# EasyEDA Pro project WM8904_mikroBUS_05.eprj

# Schematic Schematic1
Board Name: Board1; Create Date: 2025-12-05; Page Name: P1; Project Name: WM8904_MikroBUS_05; Schematic Name: Schematic1; Update Date: 2026-08-18; Company: EasyEDA.com; Page Size: A4; Version: V1.0
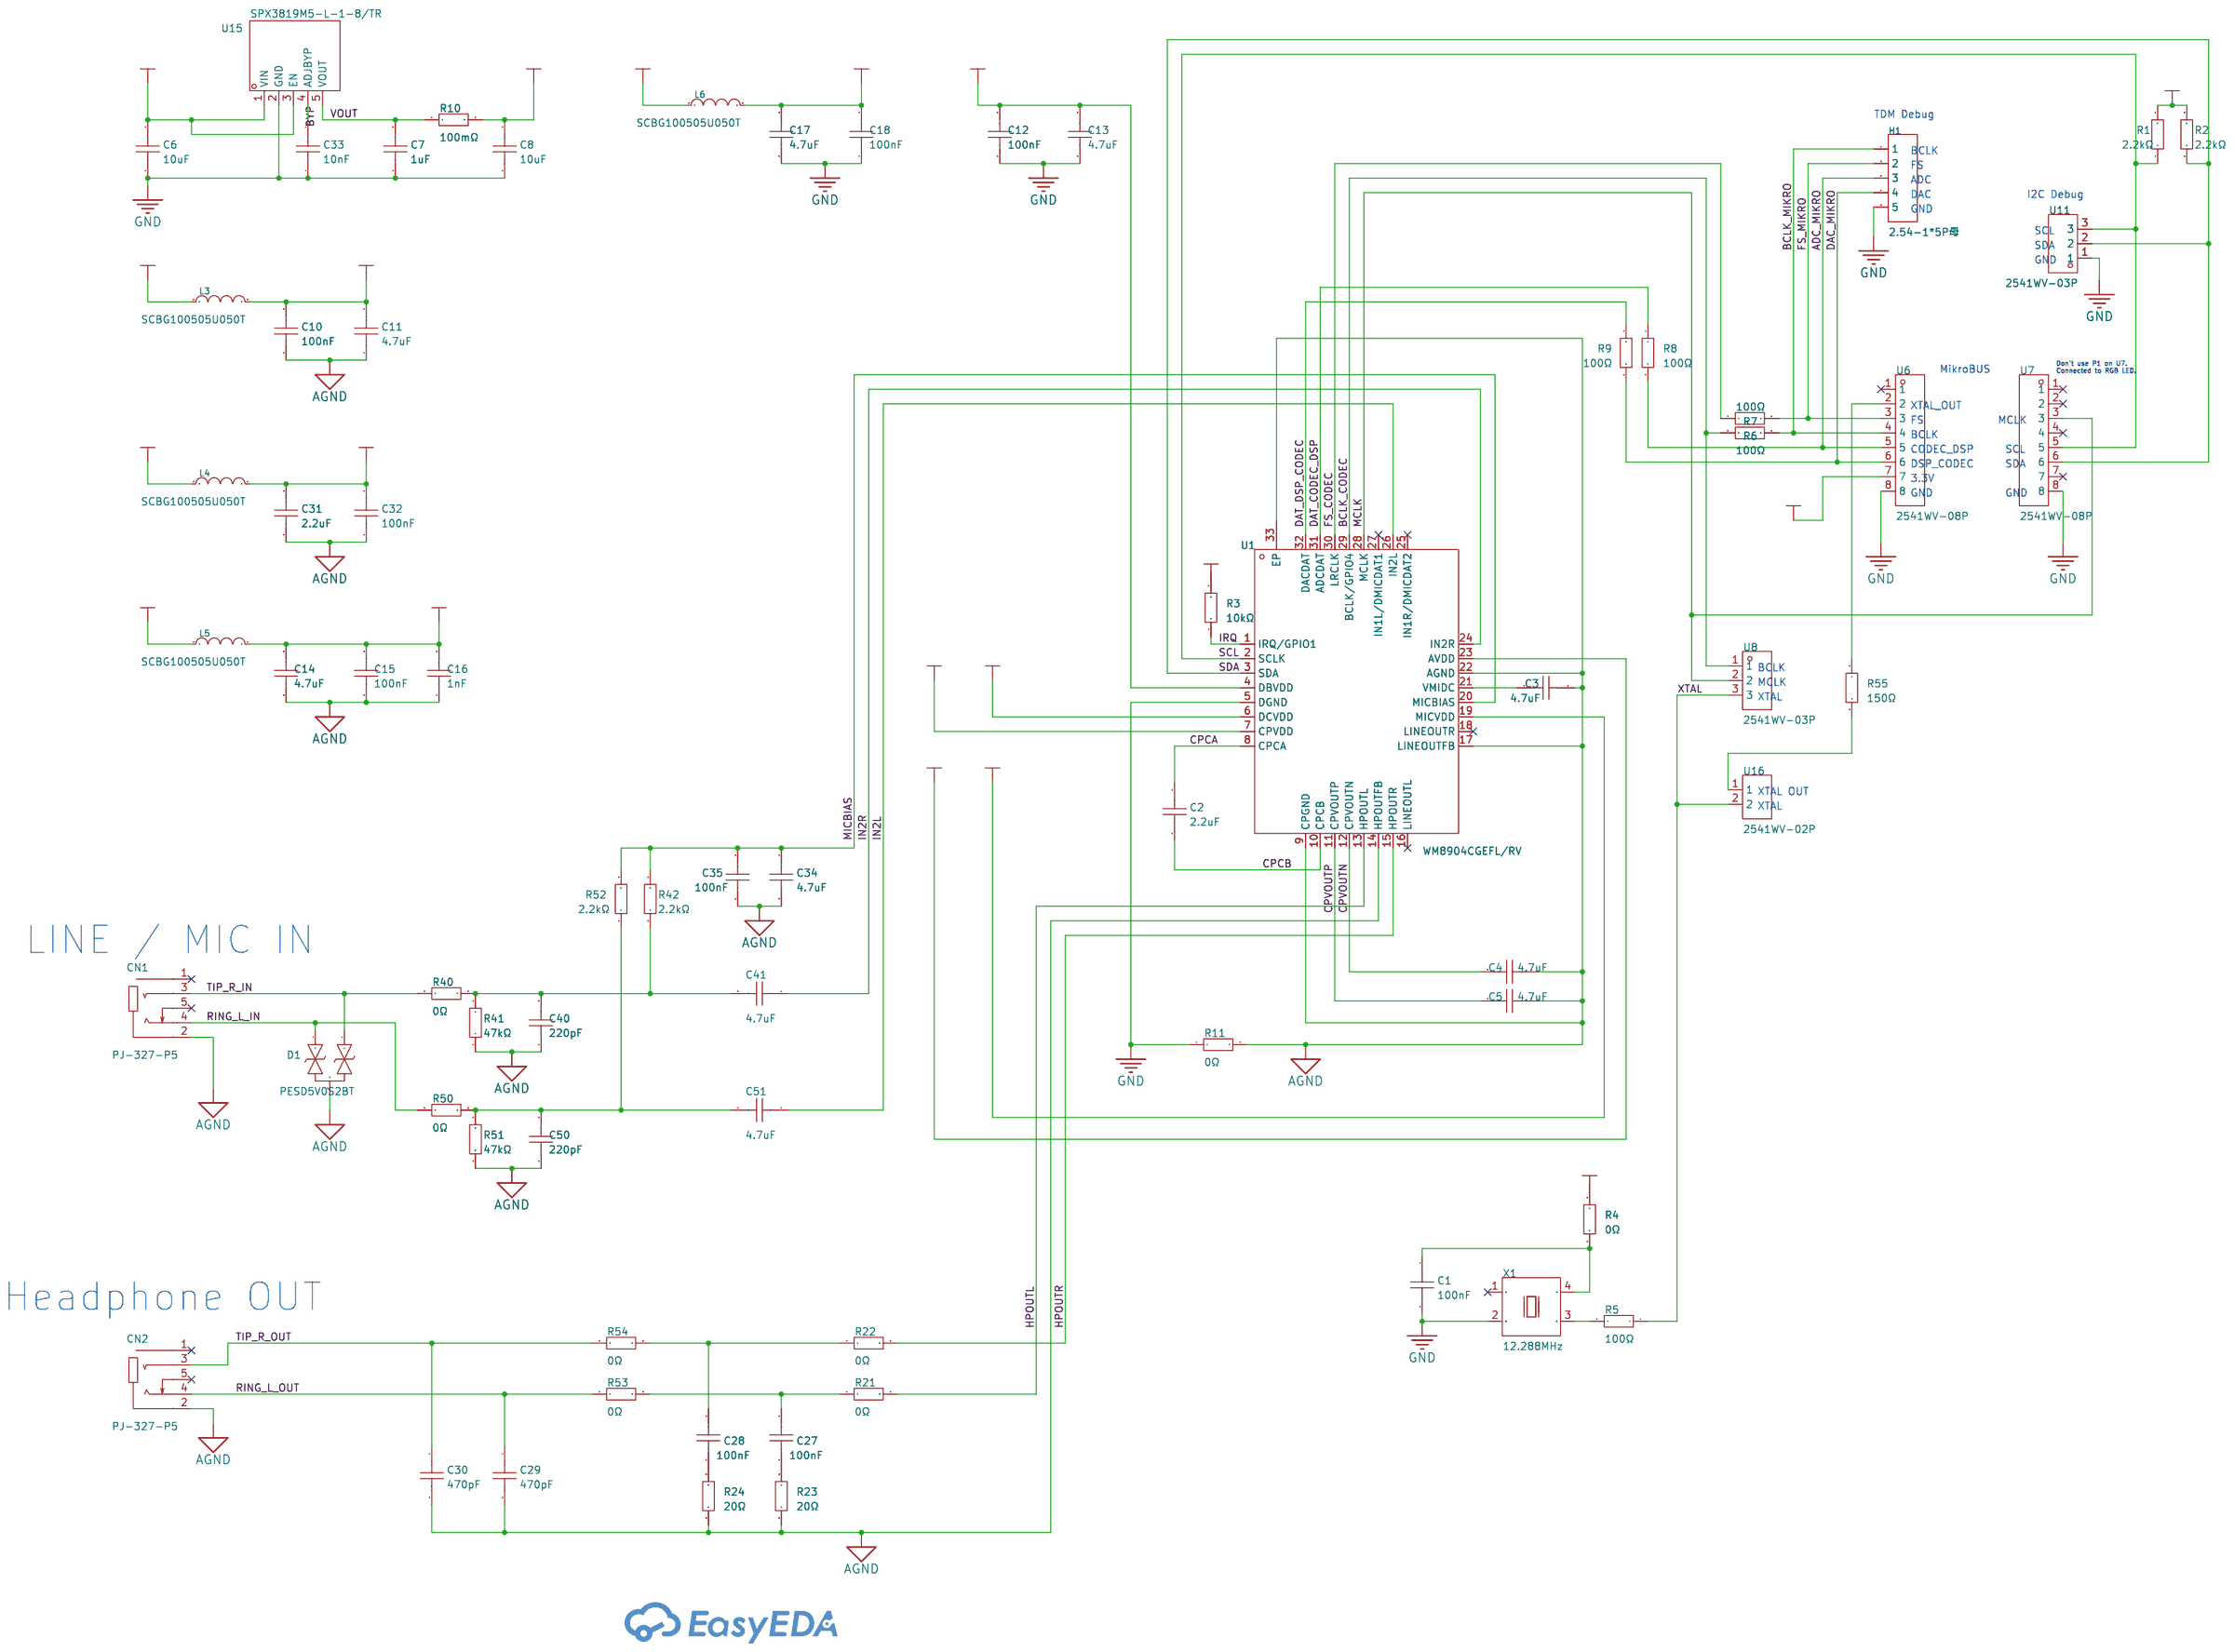
[diagram p0: schematic sheet]

## Parts
C1  100nF  [C0603]
C2  2.2uF  [C0603]
C3  4.7uF  [C0603]
C4  4.7uF  [C0603]
C5  4.7uF  [C0603]
C6  10uF  [C0603]
C7  1uF  [C0603]
C8  10uF  [C0603]
C10  100nF  [C0603]
C11  4.7uF  [C0603]
C12  100nF  [C0603]
C13  4.7uF  [C0603]
C14  4.7uF  [C0603]
C15  100nF  [C0603]
C16  1nF  [C0603]
C17  4.7uF  [C0603]
C18  100nF  [C0603]
C27  100nF  [C0603]
C28  100nF  [C0603]
C29  470pF  [C0603]
C30  470pF  [C0603]
C31  2.2uF  [C0603]
C32  100nF  [C0603]
C33  10nF  [C0603]
C34  4.7uF  [C0603]
C35  100nF  [C0603]
C40  220pF  [C0603]
C41  4.7uF  [C0603]
C50  220pF  [C0603]
C51  4.7uF  [C0603]
CN1  PJ-327-P5  [AUDIO-TH_PJ-327-P5]
CN2  PJ-327-P5  [AUDIO-TH_PJ-327-P5]
D1  PESD5V0S2BT  [SOT-23-3_L2.9-W1.3-P1.90-LS2.4-BR]
H1  2.54-1*5P母  [HDR-TH_5P-P2.54-V-F]
L3  SCBG100505U050T  [L0402]
L4  SCBG100505U050T  [L0402]
L5  SCBG100505U050T  [L0402]
L6  SCBG100505U050T  [L0402]
R1  2.2kΩ  [R0603]
R2  2.2kΩ  [R0603]
R3  10kΩ  [R0603]
R4  0Ω  [R0603]
R5  100Ω  [R0603]
R6  100Ω  [R0603]
R7  100Ω  [R0603]
R8  100Ω  [R0603]
R9  100Ω  [R0603]
R10  100mΩ  [R0603]
R11  0Ω  [R0603]
R21  0Ω  [R0603]
R22  0Ω  [R0603]
R23  20Ω  [R0603]
R24  20Ω  [R0603]
R40  0Ω  [R0603]
R41  47kΩ  [R0603]
R42  2.2kΩ  [R0603]
R50  0Ω  [R0603]
R51  47kΩ  [R0603]
R52  2.2kΩ  [R0603]
R53  0Ω  [R0603]
R54  0Ω  [R0603]
R55  150Ω  [R0603]
U1  WM8904CGEFL/RV  [QFN-32_L4.0-W4.0-P0.40-BL-EP2.7]
U6  2541WV-08P  [HDR-TH_8P-P2.54-V-M-4]
U7  2541WV-08P  [HDR-TH_8P-P2.54-V-M-4]
U8  2541WV-03P  [HDR-TH_3P-P2.54-V-M-2]
U11  2541WV-03P  [HDR-TH_3P-P2.54-V-M-2]
U15  SPX3819M5-L-1-8/TR  [SOT-23-5_L3.0-W1.7-P0.95-LS2.8-TL]
U16  2541WV-02P  [HDR-TH_2P-P2.54-V-M-1]
X1  12.288MHz  [OSC-SMD_4P-L2.5-W2.0-BL]

## Library data of the parts
C1 C10 C12 C15 C18 C27 C28 C32 = CC0603KRX7R9BB104: Capacitance:100nF Tolerance:±10% Tolerance:±10% Voltage Rating:50V Temperature Coefficient:X7R; LCSC Part Name: 100nF ±10% 50V; Supplier Part: C14663; Manufacturer: YAGEO(国巨); Supplier Footprint: 0603; JLCPCB Part Class: Basic Part; Datasheet: https://item.szlcsc.com/datasheet/CC0603KRX7R9BB104/15331.html; Supplier: LCSC; Tolerance: ±10%; Voltage Rating: 50V; Temperature Coefficient: X7R; Check: true; Standardization Check: true
C2 C31 = CL10A225KO8NNNC: Capacitance:2.2uF Tolerance:±10% Tolerance:±10% Voltage Rating:16V Temperature Coefficient:X5R; LCSC Part Name: 2.2uF ±10% 16V; Supplier Part: C23630; Manufacturer: SAMSUNG(三星); Supplier Footprint: 0603; JLCPCB Part Class: Basic Part; Datasheet: https://item.szlcsc.com/datasheet/CL10A225KO8NNNC/24366.html; Supplier: LCSC; Tolerance: ±10%; Voltage Rating: 16V; Temperature Coefficient: X5R; Check: true; Standardization Check: true
C3-C5 C11 C13 C14 C17 = CL10A475KO8NNNC: Capacitance:4.7uF Tolerance:±10% Tolerance:±10% Voltage Rating:16V Temperature Coefficient:X5R; LCSC Part Name: 4.7uF ±10% 16V; Supplier Part: C19666; Manufacturer: SAMSUNG(三星); Supplier Footprint: 0603; JLCPCB Part Class: Basic Part; Datasheet: https://item.szlcsc.com/datasheet/CL10A475KO8NNNC/20375.html; Supplier: LCSC; Tolerance: ±10%; Voltage Rating: 16V; Temperature Coefficient: X5R; Check: true; Standardization Check: true
C6 C8 = CL10A106KP8NNNC: Capacitance:10uF Tolerance:±10% Tolerance:±10% Voltage Rating:10V Temperature Coefficient:X5R; LCSC Part Name: 10uF ±10% 10V; Supplier Part: C19702; Manufacturer: SAMSUNG(三星); Supplier Footprint: 0603; JLCPCB Part Class: Basic Part; Datasheet: https://item.szlcsc.com/datasheet/CL10A106KP8NNNC/20411.html; Supplier: LCSC; Tolerance: ±10%; Voltage Rating: 10V; Temperature Coefficient: X5R; Check: true; Standardization Check: true
C7 = CL10A105KB8NNNC: Capacitance:1uF Tolerance:±10% Tolerance:±10% Voltage Rating:50V Temperature Coefficient:X5R; LCSC Part Name: 1uF ±10% 50V; Supplier Part: C15849; Manufacturer: SAMSUNG(三星); Supplier Footprint: 0603; JLCPCB Part Class: Basic Part; Datasheet: https://item.szlcsc.com/datasheet/CL10A105KB8NNNC/16531.html; Supplier: LCSC; Tolerance: ±10%; Voltage Rating: 50V; Temperature Coefficient: X5R; Check: true; Standardization Check: true
C16 = CL10B102KB8NNNC: Capacitance:1nF Tolerance:±10% Tolerance:±10% Voltage Rating:50V Temperature Coefficient:X7R; LCSC Part Name: 1nF ±10% 50V; Supplier Part: C1588; Manufacturer: SAMSUNG(三星); Supplier Footprint: 0603; JLCPCB Part Class: Basic Part; Datasheet: https://item.szlcsc.com/datasheet/CL10B102KB8NNNC/1940.html; Supplier: LCSC; Tolerance: ±10%; Voltage Rating: 50V; Temperature Coefficient: X7R; Check: true; Standardization Check: true
C29 C30 = 0603B471K500NT: Capacitance:470pF Tolerance:±10% Tolerance:±10% Voltage Rating:50V Temperature Coefficient:X7R; LCSC Part Name: 470pF ±10% 50V; Supplier Part: C1620; Manufacturer: FH(风华); Supplier Footprint: 0603; JLCPCB Part Class: Basic Part; Datasheet: https://item.szlcsc.com/datasheet/0603B471K500NT/1972.html; Supplier: LCSC; Tolerance: ±10%; Voltage Rating: 50V; Temperature Coefficient: X7R; Check: true; Standardization Check: true
C33 = 0603B103K500NT: Capacitance:10nF Tolerance:±10% Tolerance:±10% Voltage Rating:50V Temperature Coefficient:X7R; LCSC Part Name: 10nF ±10% 50V; Supplier Part: C57112; Manufacturer: FH(风华); Supplier Footprint: 0603; JLCPCB Part Class: Basic Part; Datasheet: https://item.szlcsc.com/datasheet/0603B103K500NT/58143.html; Supplier: LCSC; Tolerance: ±10%; Voltage Rating: 50V; Temperature Coefficient: X7R; Standardization Check: true; Check: true
C34 C41 C51 = CL10A475KO8NNNC: Capacitance:4.7uF Tolerance:±10% Tolerance:±10% Voltage Rating:16V Temperature Coefficient:X5R; LCSC Part Name: 4.7uF ±10% 16V; Supplier Part: C19666; Manufacturer: SAMSUNG(三星); Supplier Footprint: 0603; JLCPCB Part Class: Basic Part; Datasheet: https://item.szlcsc.com/datasheet/CL10A475KO8NNNC/20375.html; Supplier: LCSC; Tolerance: ±10%; Voltage Rating: 16V; Temperature Coefficient: X5R; Standardization Check: true; Check: true
C35 = CC0603KRX7R9BB104: Capacitance:100nF Tolerance:±10% Tolerance:±10% Voltage Rating:50V Temperature Coefficient:X7R; LCSC Part Name: 100nF ±10% 50V; Supplier Part: C14663; Manufacturer: YAGEO(国巨); Supplier Footprint: 0603; JLCPCB Part Class: Basic Part; Datasheet: https://item.szlcsc.com/datasheet/CC0603KRX7R9BB104/15331.html; Supplier: LCSC; Tolerance: ±10%; Voltage Rating: 50V; Temperature Coefficient: X7R; Standardization Check: true; Check: true
C40 C50 = CL10B221KB8NNNC: Capacitance:220pF Tolerance:±10% Tolerance:±10% Voltage Rating:50V Temperature Coefficient:X7R; LCSC Part Name: 220pF ±10% 50V; Supplier Part: C1603; Manufacturer: SAMSUNG(三星); Supplier Footprint: 0603; JLCPCB Part Class: Basic Part; Datasheet: https://item.szlcsc.com/datasheet/CL10B221KB8NNNC/1955.html; Supplier: LCSC; Tolerance: ±10%; Voltage Rating: 50V; Temperature Coefficient: X7R; Check: true; Standardization Check: true
CN1 CN2 = PJ-327-P5: LCSC Part Name: 3.5mm耳机座; Supplier Part: C428475; Manufacturer: SOFNG(硕方); Supplier Footprint: 插件; JLCPCB Part Class: Extended Part; Datasheet: https://item.szlcsc.com/datasheet/PJ-327-P5/423184.html; Supplier: LCSC; Connector Type: 3.5mm Headphone Jack; Current Rating: 25mA; Voltage Rating (Max): 24V; Contact Material: Phosphor Bronze; Operating Temperature: -25℃~+75℃; Standardization Check: true; Check: true
D1 = PESD5V0S2BT_C28310457: LCSC Part Name: 双向ESD 5V截止 峰值脉冲电流：16A; Supplier Part: C28310457; Manufacturer: GOODWORK(固得沃克); Supplier Footprint: SOT-23; JLCPCB Part Class: Extended Part; Datasheet: https://item.szlcsc.com/datasheet/PESD5V0S2BT/30046927.html; Supplier: LCSC; Polarity: Bidirectional; Reverse Stand-Off Voltage (Vrwm): 5V; Clamping Voltage: 11V; Peak Pulse Current (Ipp): 16A; Peak Pulse Power Dissipation (Ppp): 250W; Voltage - Breakdown: 6V; Reverse Leakage Current (Ir): 10nA; Number of Channels: 2; Operating Temperature: -55℃~+125℃; level of protection: IEC 61000-4-4；IEC 61000-4-2; Type: ESD; Junction Capacitance: 35pF; Standardization Check: true; Check: true
H1 = 2.54-1*5P母: LCSC Part Name: 1x5P 间距:2.54mm 直插; Supplier Part: C50950; Manufacturer: BOOMELE(博穆精密); Supplier Footprint: 插件,P=2.54mm; JLCPCB Part Class: Extended Part; Datasheet: https://item.szlcsc.com/datasheet/2.54-1*5P%25E6%25AF%258D/51962.html; Supplier: LCSC; Holes Structure: 1x5P; Pitch: 2.54mm; Circular Hole / Square Hole: Square Hole; Mounting Type: Through Hole; Number of Rows: 1; Number of Positions: 5P; Current Rating: 3A; Holes Direction: Top; Insulation Height: 8.5mm; Contact Material: Brass; Contact Plating: Gold; Operating Temperature: -55℃~+105℃; PIN Length: 3.2mm; Check: true
L3-L6 = SCBG100505U050T: LCSC Part Name: (0~15)Ω 300mA; Supplier Part: C480821; Manufacturer: Yanchuang(研创); Supplier Footprint: 0402; JLCPCB Part Class: Extended Part; Datasheet: https://item.szlcsc.com/datasheet/SCBG100505U050T/488146.html; Supplier: LCSC; Impedance @ Frequency: 5Ω@100MHz; DC Resistance(DCR): 100mΩ; Current Rating: 300mA; Operating Temperature: -55℃~+125℃; Check: true
R1 R2 = 0603WAF2201T5E_C4190: Type:Thick Film Resistors Resistance:2.2kΩ Tolerance:±1% Tolerance:±1% Power(Watts): Overload Voltage (Max): Temperature Coefficient:±100ppm/℃ Temperature Coefficient:±100ppm/℃ Operating Temperature Range:-55℃~+155℃ Operating Temperature Range:-55℃~+155℃; LCSC Part Name: 2.2kΩ ±1% 100mW 厚膜电阻; Supplier Part: C4190; Manufacturer: UNI-ROYAL(厚声); Manufacturer Part: 0603WAF2201T5E; Supplier Footprint: 0603; JLCPCB Part Class: Basic Part; Datasheet: https://atta.szlcsc.com/upload/public/pdf/source/20200306/C422600_1E6D84923E4A46A82E41ADD87F860B5C.pdf; Supplier: LCSC; Type: Thick Film Resistors; Tolerance: ±1%; Temperature Coefficient: ±100ppm/℃; Operating Temperature Range: -55℃~+155℃; Check: true; Standardization Check: true
R3 = 0603WAF1002T5E: Type:Thick Film Resistor Resistance:10kΩ Tolerance:±1% Tolerance:±1% Power(Watts):100mW Voltage-Supply(Max):75V Temperature Coefficient:±100ppm/℃ Temperature Coefficient:±100ppm/℃ Operating Temperature:-55℃~+155℃ Operating Temperature:-55℃~+155℃; LCSC Part Name: 厚膜电阻 10kΩ ±1% 100mW; Supplier Part: C25804; Manufacturer: UNI-ROYAL(厚声); Supplier Footprint: 0603; JLCPCB Part Class: Basic Part; Datasheet: https://item.szlcsc.com/datasheet/0603WAF1002T5E/26547.html; Supplier: LCSC; Type: Thick Film Resistor; Tolerance: ±1%; Power(Watts): 100mW; Voltage-Supply(Max): 75V; Temperature Coefficient: ±100ppm/℃; Operating Temperature: -55℃~+155℃; Check: true; Standardization Check: true
R4 R11 R21 R22 R53 R54 = 0603WAF0000T5E: Type:Thick Film Resistor Resistance:0Ω Tolerance:±1% Tolerance:±1% Power(Watts):100mW Voltage-Supply(Max):75V Temperature Coefficient:- Temperature Coefficient:- Operating Temperature:-55℃~+155℃ Operating Temperature:-55℃~+155℃; LCSC Part Name: 0Ω ±1% 100mW 厚膜电阻; Supplier Part: C21189; Manufacturer: UNI-ROYAL(厚声); Supplier Footprint: 0603; JLCPCB Part Class: Basic Part; Datasheet: https://item.szlcsc.com/datasheet/0603WAF0000T5E/21903.html; Supplier: LCSC; Type: Thick Film Resistor; Tolerance: ±1%; Power(Watts): 100mW; Voltage-Supply(Max): 75V; Operating Temperature: -55℃~+155℃; Check: true; Standardization Check: true
R5-R9 = 0603WAF1000T5E: Type:Thick Film Resistors Resistance: Tolerance:±1% Tolerance:±1% Power(Watts): Overload Voltage (Max): Temperature Coefficient:±200ppm/℃ Temperature Coefficient:±200ppm/℃ Operating Temperature Range:-55℃~+155℃ Operating Temperature Range:-55℃~+155℃; LCSC Part Name: 100Ω ±1% 100mW 厚膜电阻; Supplier Part: C22775; Manufacturer: UNI-ROYAL(厚声); Supplier Footprint: 0603; JLCPCB Part Class: Basic Part; Datasheet: https://atta.szlcsc.com/upload/public/pdf/source/20200306/C422600_1E6D84923E4A46A82E41ADD87F860B5C.pdf; Supplier: LCSC; Type: Thick Film Resistors; Tolerance: ±1%; Temperature Coefficient: ±200ppm/℃; Operating Temperature Range: -55℃~+155℃; Check: true; Standardization Check: true
R10 = 0603WAJ010KT5E: Type:Thick Film Resistor Resistance:100mΩ Tolerance:±5% Tolerance:±5% Power(Watts):100mW Voltage-Supply(Max):75V Temperature Coefficient:±800ppm/℃ Temperature Coefficient:±800ppm/℃ Operating Temperature:-55℃~+155℃ Operating Temperature:-55℃~+155℃; LCSC Part Name: 100mΩ ±5% 100mW 厚膜电阻; Supplier Part: C247025; Manufacturer: UNI-ROYAL(厚声); Supplier Footprint: 0603; JLCPCB Part Class: Extended Part; Datasheet: https://item.szlcsc.com/datasheet/0603WAJ010KT5E/244233.html; Supplier: LCSC; Type: Thick Film Resistor; Tolerance: ±5%; Power(Watts): 100mW; Voltage-Supply(Max): 75V; Temperature Coefficient: ±800ppm/℃; Operating Temperature: -55℃~+155℃; Check: true; Standardization Check: true
R23 R24 = 0603WAF200JT5E: Type:Thick Film Resistors Resistance:20Ω Tolerance:±1% Tolerance:±1% Power(Watts): Overload Voltage (Max): Temperature Coefficient:±100ppm/℃ Temperature Coefficient:±100ppm/℃ Operating Temperature Range:-55℃~+155℃ Operating Temperature Range:-55℃~+155℃; LCSC Part Name: 20Ω ±1% 100mW 厚膜电阻; Supplier Part: C22950; Manufacturer: UNI-ROYAL(厚声); Supplier Footprint: 0603; JLCPCB Part Class: Basic Part; Datasheet: https://atta.szlcsc.com/upload/public/pdf/source/20200306/C422600_1E6D84923E4A46A82E41ADD87F860B5C.pdf; Supplier: LCSC; Type: Thick Film Resistors; Tolerance: ±1%; Temperature Coefficient: ±100ppm/℃; Operating Temperature Range: -55℃~+155℃; Check: true; Standardization Check: true
R40 R50 = 0603WAF0000T5E: Type:Thick Film Resistor Resistance:0Ω Tolerance:±1% Tolerance:±1% Power(Watts):100mW Voltage-Supply(Max):75V Temperature Coefficient:- Temperature Coefficient:- Operating Temperature:-55℃~+155℃ Operating Temperature:-55℃~+155℃; LCSC Part Name: 0Ω ±1% 100mW 厚膜电阻; Supplier Part: C21189; Manufacturer: UNI-ROYAL(厚声); Supplier Footprint: 0603; JLCPCB Part Class: Basic Part; Datasheet: https://item.szlcsc.com/datasheet/0603WAF0000T5E/21903.html; Supplier: LCSC; Type: Thick Film Resistor; Tolerance: ±1%; Power(Watts): 100mW; Voltage-Supply(Max): 75V; Operating Temperature: -55℃~+155℃; Standardization Check: true; Check: true
R41 R51 = 0603WAF4702T5E: Type:Thick Film Resistor Resistance:47kΩ Tolerance:±1% Tolerance:±1% Power(Watts):100mW Voltage-Supply(Max):75V Temperature Coefficient:±100ppm/℃ Temperature Coefficient:±100ppm/℃ Operating Temperature:-55℃~+155℃ Operating Temperature:-55℃~+155℃; LCSC Part Name: 47kΩ ±1% 100mW 厚膜电阻; Supplier Part: C25819; Manufacturer: UNI-ROYAL(厚声); Supplier Footprint: 0603; JLCPCB Part Class: Basic Part; Datasheet: https://item.szlcsc.com/datasheet/0603WAF4702T5E/26562.html; Supplier: LCSC; Type: Thick Film Resistor; Tolerance: ±1%; Power(Watts): 100mW; Voltage-Supply(Max): 75V; Temperature Coefficient: ±100ppm/℃; Operating Temperature: -55℃~+155℃; Standardization Check: true; Check: true
R42 R52 = 0603WAF2201T5E_C4190: Type:Thick Film Resistors Resistance:2.2kΩ Tolerance:±1% Tolerance:±1% Power(Watts): Overload Voltage (Max): Temperature Coefficient:±100ppm/℃ Temperature Coefficient:±100ppm/℃ Operating Temperature Range:-55℃~+155℃ Operating Temperature Range:-55℃~+155℃; LCSC Part Name: 2.2kΩ ±1% 100mW 厚膜电阻; Supplier Part: C4190; Manufacturer: UNI-ROYAL(厚声); Manufacturer Part: 0603WAF2201T5E; Supplier Footprint: 0603; JLCPCB Part Class: Basic Part; Datasheet: https://atta.szlcsc.com/upload/public/pdf/source/20200306/C422600_1E6D84923E4A46A82E41ADD87F860B5C.pdf; Supplier: LCSC; Type: Thick Film Resistors; Tolerance: ±1%; Temperature Coefficient: ±100ppm/℃; Operating Temperature Range: -55℃~+155℃; Standardization Check: true; Check: true
R55 = 0603WAF1500T5E: Type:Thick Film Resistors Resistance: Tolerance:±1% Tolerance:±1% Power(Watts): Overload Voltage (Max): Temperature Coefficient:±100ppm/℃ Temperature Coefficient:±100ppm/℃ Operating Temperature Range:-55℃~+155℃ Operating Temperature Range:-55℃~+155℃; LCSC Part Name: 150Ω ±1% 100mW 厚膜电阻; Supplier Part: C22808; Manufacturer: UNI-ROYAL(厚声); Supplier Footprint: 0603; JLCPCB Part Class: Basic Part; Datasheet: https://atta.szlcsc.com/upload/public/pdf/source/20200306/C422600_1E6D84923E4A46A82E41ADD87F860B5C.pdf; Supplier: LCSC; Type: Thick Film Resistors; Tolerance: ±1%; Temperature Coefficient: ±100ppm/℃; Operating Temperature Range: -55℃~+155℃; Check: true
U1 = WM8904CGEFL/RV: LCSC Part Name: 适用于便携式音频应用的超低功耗编解码器; Supplier Part: C323845; Manufacturer: Cirrus Logic(凌云); Supplier Footprint: VQFN-32-EP(4x4); JLCPCB Part Class: Extended Part; Datasheet: https://item.szlcsc.com/datasheet/WM8904CGEFL%252FRV/304623.html; Supplier: LCSC; Type: Codec; Sampling Rate: 8kHz~96kHz; Voltage - Supply: 950mV~1.98V；1.71V~2V；1.42V~3.6V; Operating Temperature: -40℃~+85℃; Check: true; Standardization Check: true
U6 U7 = 2541WV-08P: LCSC Part Name: 1x8P 间距:2.54mm 方针 直插; Supplier Part: C5383116; Manufacturer: HanElectricity(瀚源); Supplier Footprint: 插件,P=2.54mm; JLCPCB Part Class: Extended Part; Datasheet: https://item.szlcsc.com/datasheet/2541WV-08P/6258476.html; Supplier: LCSC; Pin Structure: 1x8P; Pitch: 2.54mm; Circluar Pins/Square Pins: Pin Header; Mounting Type: Through Hole; Number of Rows: 1; Number of Pins: 8P; Length of Mating Pin: 6mm; Insulation Height: 2.54mm; Length of End Connection Pin: 3mm; Contact Plating: Gold; Operating Temperature: -55℃~+105℃; Check: true; Standardization Check: true
U8 U11 = 2541WV-03P: LCSC Part Name: 1x3P 间距:2.54mm 方针 直插; Supplier Part: C5383112; Manufacturer: HanElectricity(瀚源); Supplier Footprint: 插件,P=2.54mm; JLCPCB Part Class: Extended Part; Datasheet: https://item.szlcsc.com/datasheet/2541WV-03P/6258472.html; Supplier: LCSC; Pin Structure: 1x3P; Pitch: 2.54mm; Circluar Pins/Square Pins: Pin Header; Mounting Type: Through Hole; Number of Rows: 1; Number of Pins: 3P; Length of Mating Pin: 6mm; Insulation Height: 2.54mm; Length of End Connection Pin: 3mm; Contact Plating: Gold; Operating Temperature: -55℃~+105℃; Check: true; Standardization Check: true
U15 = SPX3819M5-L-1-8/TR: LCSC Part Name: 输入16V 输出1.8V~1.8V 500mA; Supplier Part: C24639; Manufacturer: MaxLinear(迈凌); Supplier Footprint: SOT-23-5; JLCPCB Part Class: Extended Part; Datasheet: https://item.szlcsc.com/datasheet/SPX3819M5-L-1-8%252FTR/25380.html; Supplier: LCSC; Output Type: Fixed; Voltage - Supply: 20V; Output Voltage: 1.8V; Output Current: 500mA; Power Supply Rejection Ratio (PSRR): 70dB; Voltage Dropout: 340mV@(500mA); standby current: 90uA; Noise: 40uVrms; Features: Over Current Protection；Reverse Polarity Protection；Over Temperature Protection；Enable; Operating Temperature: -40℃~+125℃@(Tj); Output Configuration: Positive; Number of Outputs: 1; Check: true; Standardization Check: true
U16 = 2541WV-02P: LCSC Part Name: 1x2P 间距:2.54mm 方针 直插; Supplier Part: C5383111; Manufacturer: HanElectricity(瀚源); Supplier Footprint: 插件,P=2.54mm; JLCPCB Part Class: Extended Part; Datasheet: https://item.szlcsc.com/datasheet/2541WV-02P/6258471.html; Supplier: LCSC; Pin Structure: 1x2P; Pitch: 2.54mm; Circluar Pins/Square Pins: Pin Header; Mounting Type: Through Hole; Number of Rows: 1; Number of Pins: 2P; Length of Mating Pin: 6mm; Insulation Height: 2.54mm; Length of End Connection Pin: 3mm; Contact Plating: Gold; Operating Temperature: -55℃~+105℃; Check: true
X1 = X1G0041710019: LCSC Part Name: X1G004171001900; Supplier Part: C255992; Manufacturer: EPSON(爱普生); Supplier Footprint: SMD2520-4P; JLCPCB Part Class: Extended Part; Datasheet: https://item.szlcsc.com/datasheet/X1G0041710019/249757.html; Supplier: LCSC; Normal temperature Frequency Tolerance: ±50ppm; Output Type: CMOS; Voltage - Supply: 1.62V~3.63V; Current - Supply: 1.8mA; Operating Temperature: -40℃~+85℃; Check: true; Standardization Check: true

## Nets
+3.3V: C6.2 C12.2 C13.2 L3.1 R1.2 R2.2 R3.2 R4.2 U1.4(DBVDD) U6.7 U15.1(VIN) U15.3(EN)
AGND: C3.2 C4.1 C5.1 C10.1 C11.1 C14.1 C15.1 C16.1 C29.2 C30.2 C31.1 C32.1 C34.2 C35.2 C40.1 C50.1 CN1.2 CN2.2 D1.3 R11.2 R23.1 R24.1 R41.1 R51.1 U1.9(CPGND) U1.14(HPOUTFB) U1.17(LINEOUTFB) U1.22(AGND) U1.33(EP)
AVDD: C31.2 C32.2 L4.2 U1.23(AVDD)
GND: C1.2 C6.1 C7.1 C8.1 C12.1 C13.1 C17.1 C18.1 C33.1 H1.5 R11.1 U1.5(DGND) U6.8 U7.8 U11.1 U15.2(GND) X1.2(GND)
VCC_P1V8: C8.2 L4.1 L5.1 L6.1 R10.2
ADC_MIKRO: H1.3 R8.2 U6.5
BCLK_CODEC: R6.2 U1.29(BCLK/GPIO4) U8.1
BCLK_MIKRO: H1.1 R6.1 U6.4
BYP: C33.2 U15.4(ADJBYP)
CPCA: C2.1 U1.8(CPCA)
CPCB: C2.2 U1.10(CPCB)
CPVDD: C14.2 C15.2 C16.2 L5.2 U1.7(CPVDD)
CPVOUTN: C4.2 U1.12(CPVOUTN)
CPVOUTP: C5.2 U1.11(CPVOUTP)
DAC_MIKRO: H1.4 R9.2 U6.6
DAT_CODEC_DSP: R8.1 U1.31(ADCDAT)
DAT_DSP_CODEC: R9.1 U1.32(DACDAT)
DCVDD: C17.2 C18.2 L6.2 U1.6(DCVDD)
FS_CODEC: R7.1 U1.30(LRCLK)
FS_MIKRO: H1.2 R7.2 U6.3
HPOUTL: R21.2 U1.13(HPOUTL)
HPOUTR: R22.2 U1.15(HPOUTR)
IN2L: C51.1 U1.26(IN2L)
IN2R: C41.1 U1.24(IN2R)
IRQ: R3.1 U1.1(IRQ/GPIO1)
MCLK: U1.28(MCLK) U7.3 U8.2
MICBIAS: C34.1 C35.1 R42.2 R52.2 U1.20(MICBIAS)
MICVDD: C10.2 C11.2 L3.2 U1.19(MICVDD)
RING_L_IN: CN1.4 D1.2 R50.1
RING_L_OUT: C29.1 CN2.4 R53.1
SCL: R1.1 U1.2(SCLK) U7.5 U11.3
SDA: R2.1 U1.3(SDA) U7.6 U11.2
TIP_R_IN: CN1.3 D1.1 R40.1
TIP_R_OUT: C30.1 CN2.3 R54.1
VOUT: C7.2 R10.1 U15.5(VOUT)
XTAL: R5.1 U8.3 U16.2
$1N1956: C1.1 R4.1 X1.4(VDD)
$1N2019: R5.2 X1.3(OUT)
$1N2542: C3.1 U1.21(VMIDC)
$1N6160: C27.2 R23.2
$1N6186: C28.2 R24.2
$1N6190: C28.1 R22.1 R54.2
$1N48473: C40.2 C41.2 R40.2 R41.2 R42.1
$1N48477: C50.2 C51.2 R50.2 R51.2 R52.1
$1N58808: C27.1 R21.1 R53.2
$1N85452: R55.2 U16.1
$1N87497: R55.1 U6.2

Not connected (* = marked no-connect by the designer): CN1 1* 5*; CN2 1* 5*; U1 16(LINEOUTL)* 18(LINEOUTR)* 25(IN1R/DMICDAT2)* 27(IN1L/DMICDAT1)*; U6 1*; U7 1* 2* 4* 7*; X1 1(/ST)*

## Notes on the sheet
- TDM Debug
- BCLK
- FS
- ADC
- DAC
- GND
- I2C Debug
- SCL
- GND
- SDA
- MikroBUS
- Don't use P1 on U7.
  Connected to RGB LED.
- XTAL_OUT
- FS
- MCLK
- BCLK
- CODEC_DSP
- SCL
- DSP_CODEC
- SDA
- 3.3V
- GND
- GND
- BCLK
- MCLK
- XTAL
- XTAL OUT
- XTAL
- LINE / MIC IN
- Headphone OUT

# Board PCB1
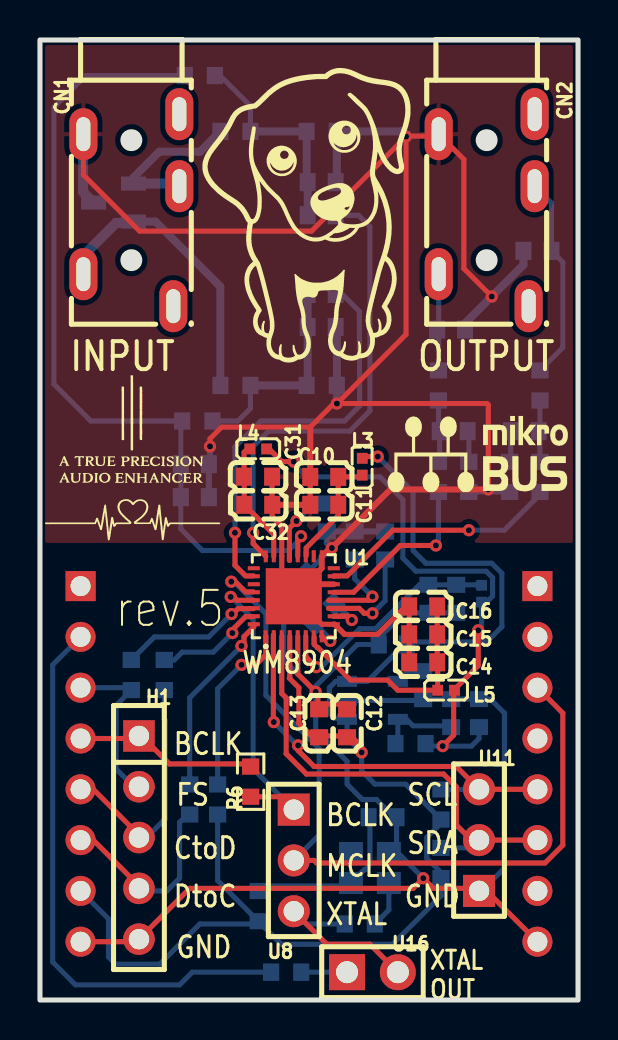
[diagram p1: board, top side]
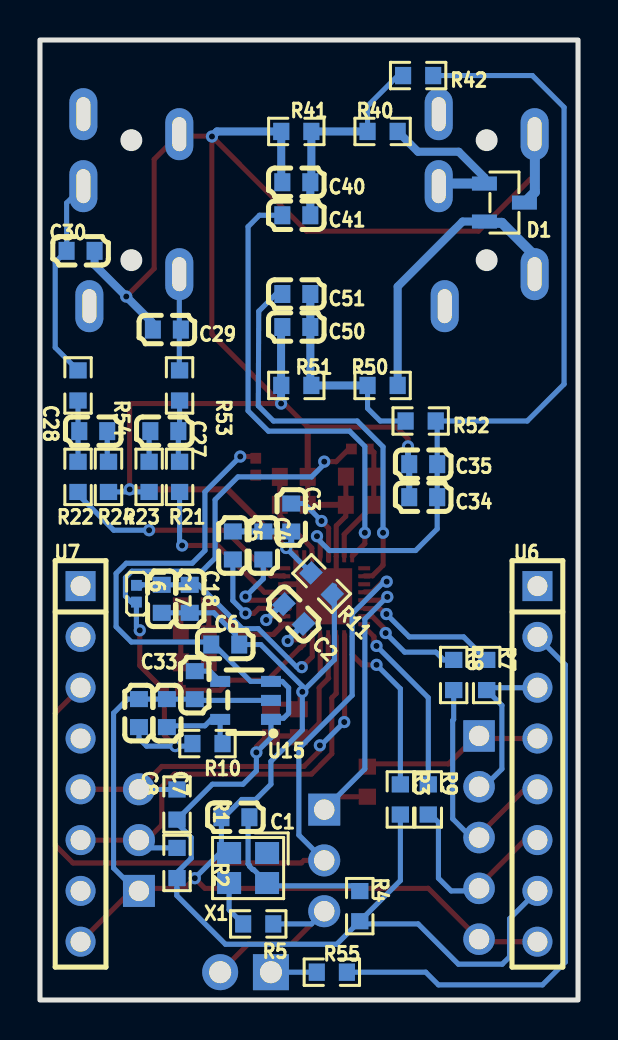
[diagram p2: board, bottom side, seen from below]

Outline 26.92 x 48 mm; copper layers: Top Layer, Bottom Layer. Coordinates in mm from the lower left corner of the outline.
Outline path: rectangle 0,48 26.92,0
Stack: Top Layer 0.035mm / Dielectric1 1.51mm FR4 er 4.5 / Bottom Layer 0.035mm

## Design rules (mm)
template: Custom Config
spacing copperThickness1oz (default): track to track 0.112, other pairs 0.152 to 0.3
spacing copperThickness2oz: track to track 0.203, other pairs 0.152 to 0.3
track width copperThickness1oz (default): min 0.127, default 0.254, max 2.54
track width copperThickness2oz: min 0.203, default 0.254, max 2.54
differential pair differentialPair (default): width min 0.127, default 0.254, max 2.54; gap min 0.152, default 0.152
via viaSize (default): diameter min 0.5, default 0.61, max 10; hole min 0.3, default 0.305, max 6.3

## Placement (name value [footprint] x y rotation side)
C1  100nF  [C0603]  17.15 9.14 0 bottom
C2  2.2uF  [C0603]  14.22 19.3 45 bottom
C3  4.7uF  [C0603]  14.35 24.12 270 bottom
C4  4.7uF  [C0603]  15.75 22.73 270 bottom
C5  4.7uF  [C0603]  17.27 22.73 270 bottom
C6  10uF  [C0603]  17.65 17.77 0 bottom
C7  1uF  [C0603]  20.57 14.34 270 bottom
C8  10uF  [C0603]  21.97 14.34 270 bottom
C10  100nF  [C0603]  14.22 26.16 0 top
C11  4.7uF  [C0603]  14.22 24.76 0 top
C12  100nF  [C0603]  15.37 13.84 270 top
C13  4.7uF  [C0603]  13.97 13.84 270 top
C14  4.7uF  [C0603]  19.18 16.89 0 top
C15  100nF  [C0603]  19.18 18.28 0 top
C16  1nF  [C0603]  19.18 19.68 0 top
C17  4.7uF  [C0603]  20.83 20.06 90 bottom
C18  100nF  [C0603]  19.43 20.06 90 bottom
C27  100nF  [C0603]  20.7 28.44 0 bottom
C28  100nF  [C0603]  24.26 28.44 180 bottom
C29  470pF  [C0603]  20.57 33.52 0 bottom
C30  470pF  [C0603]  24.89 37.46 180 bottom
C31  2.2uF  [C0603]  10.91 26.17 180 top
C32  100nF  [C0603]  10.92 24.76 180 top
C33  10nF  [C0603]  19.18 15.74 90 bottom
C34  4.7uF  [C0603]  7.75 25.14 0 bottom
C35  100nF  [C0603]  7.75 26.79 0 bottom
C40  220pF  [C0603]  14.1 40.89 180 bottom
C41  4.7uF  [C0603]  14.1 39.24 180 bottom
C50  220pF  [C0603]  14.1 33.65 180 bottom
C51  4.7uF  [C0603]  14.1 35.3 180 bottom
CN1  PJ-327-P5  [AUDIO-TH_PJ-327-P5]  4.57 39.49 0 top
CN2  PJ-327-P5  [AUDIO-TH_PJ-327-P5]  22.35 39.49 0 top
D1  PESD5V0S2BT  [SOT-23-3_L2.9-W1.3-P1.90-LS2.4-BR]  3.68 39.87 0 bottom
H1  2.54-1*5P母  [HDR-TH_5P-P2.54-V-F]  4.95 8.12 270 top
L3  SCBG100505U050T  [L0402]  16.13 26.66 270 top
L4  SCBG100505U050T  [L0402]  10.92 27.55 180 top
L5  SCBG100505U050T  [L0402]  20.32 15.49 180 top
L6  SCBG100505U050T  [L0402]  22.1 20.31 90 bottom
R1  2.2kΩ  [R0603]  20.07 9.77 270 bottom
R2  2.2kΩ  [R0603]  20.07 6.85 270 bottom
R3  10kΩ  [R0603]  8.89 10.03 270 bottom
R4  0Ω  [R0603]  10.92 4.69 270 bottom
R5  100Ω  [R0603]  16 3.8 0 bottom
R6  100Ω  [R0603]  10.54 10.92 270 top
R7  100Ω  [R0603]  4.57 16.25 270 bottom
R8  100Ω  [R0603]  6.22 16.25 270 bottom
R9  100Ω  [R0603]  7.49 10.03 270 bottom
R10  100mΩ  [R0603]  18.54 12.82 0 bottom
R11  0Ω  [R0603]  12.83 20.82 45 bottom
R21  0Ω  [R0603]  19.94 26.16 270 bottom
R22  0Ω  [R0603]  25.02 26.16 270 bottom
R23  20Ω  [R0603]  21.46 26.16 90 bottom
R24  20Ω  [R0603]  23.5 26.16 90 bottom
R40  0Ω  [R0603]  9.78 43.43 0 bottom
R41  47kΩ  [R0603]  14.1 43.43 180 bottom
R42  2.2kΩ  [R0603]  8 46.22 180 bottom
R50  0Ω  [R0603]  9.78 30.73 0 bottom
R51  47kΩ  [R0603]  14.1 30.73 180 bottom
R52  2.2kΩ  [R0603]  7.87 28.95 180 bottom
R53  0Ω  [R0603]  19.94 30.73 270 bottom
R54  0Ω  [R0603]  25.02 30.73 270 bottom
R55  150Ω  [R0603]  12.32 1.39 0 bottom
U1  WM8904CGEFL/RV  [QFN-32_L4.0-W4.0-P0.40-BL-EP2.7]  12.7 20.19 0 top
U6  2541WV-08P  [HDR-TH_8P-P2.54-V-M-4]  2.03 11.81 270 bottom
U7  2541WV-08P  [HDR-TH_8P-P2.54-V-M-4]  24.89 11.81 270 bottom
U8  2541WV-03P  [HDR-TH_3P-P2.54-V-M-2]  12.7 6.98 90 top
U11  2541WV-03P  [HDR-TH_3P-P2.54-V-M-2]  21.97 8 270 top
U15  SPX3819M5-L-1-8/TR  [SOT-23-5_L3.0-W1.7-P0.95-LS2.8-TL]  16.64 14.98 0 bottom
U16  2541WV-02P  [HDR-TH_2P-P2.54-V-M-1]  16.64 1.39 0 top
X1  12.288MHz  [OSC-SMD_4P-L2.5-W2.0-BL]  16.51 6.6 0 bottom

## Footprints (pads in the part's own frame, mm; a bottom-side part is the same pattern mirrored in y, then rotated)
AUDIO-TH_PJ-327-P5
  oval 1.4x2.6 hole 0.7x1.7: 1(2.4,4.8) 2(-2.4,3.8) 3(2.4,1.2) 4(-2.4,-3.2) 5(2.1,-4.8)
C0603
  rect 0.8x0.9 smd: 1(-0.7,0) 2(0.7,0)
HDR-TH_2P-P2.54-V-M-1
  rect 1.8x1.8 hole 1.1: 1(-1.27,0)
  round 1.8 hole 1.1: 2(1.27,0)
HDR-TH_3P-P2.54-V-M-2
  rect 1.6x1.6 hole 1.02: 1(2.54,0)
  round 1.6 hole 1.02: 2(0,0) 3(-2.54,0)
HDR-TH_5P-P2.54-V-F
  rect 1.575x1.575 hole 1.02: 1(-5.08,0)
  round 1.575 hole 1.02: 2(-2.54,0) 3(0,0) 4(2.54,0) 5(5.08,0)
HDR-TH_8P-P2.54-V-M-4
  rect 1.5x1.5 hole 1: 1(-8.89,0)
  round 1.5 hole 1: 2(-6.35,0) 3(-3.81,0) 4(-1.27,0) 5(1.27,0) 6(3.81,0) 7(6.35,0) 8(8.89,0)
L0402
  rect 0.54x0.54 smd: 1(-0.42,0) 2(0.42,0)
OSC-SMD_4P-L2.5-W2.0-BL
  rect 1.2x1.1 smd: 1(-0.95,-0.75) 2(0.95,-0.75) 3(0.95,0.75) 4(-0.95,0.75)
QFN-32_L4.0-W4.0-P0.40-BL-EP2.7
  rect 0.2x0.6 smd: 1(-1.4,-2) 2(-1,-2) 3(-0.6,-2) 4(-0.2,-2) 5(0.2,-2) 6(0.6,-2) 7(1,-2) 8(1.4,-2) 17(1.4,2) 18(1,2) 19(0.6,2) 20(0.2,2) 21(-0.2,2) 22(-0.6,2) 23(-1,2) 24(-1.4,2)
  rect 0.6x0.2 smd: 9(2,-1.4) 10(2,-1) 11(2,-0.6) 12(2,-0.2) 13(2,0.2) 14(2,0.6) 15(2,1) 16(2,1.4) 25(-2,1.4) 26(-2,1) 27(-2,0.6) 28(-2,0.2) 29(-2,-0.2) 30(-2,-0.6) 31(-2,-1) 32(-2,-1.4)
  rect 2.8x2.8 smd: 33(0,0)
R0603
  rect 0.806x0.864 smd: 1(-0.753,0) 2(0.753,0)
SOT-23-3_L2.9-W1.3-P1.90-LS2.4-BR
  rect 1.25x0.7 smd: 1(1,-0.95) 2(1,0.95) 3(-1,0)
SOT-23-5_L3.0-W1.7-P0.95-LS2.8-TL
  rect 1x0.55 smd: 1(-1.272,0.95) 2(-1.272,0) 3(-1.272,-0.95) 4(1.272,-0.95) 5(1.272,0.95)

## Nets
As in the schematic.

Pads without a net: CN1 1 5; CN2 1 5; U1 16 18 25 27; U6 1; U7 1 2 4 7; X1 1

## Via types
v1: diameter 0.61, hole 0.305, Top Layer to Bottom Layer, 32 vias

## Routing (per net, layer and track width the routed paths; a pad name or vN(x,y) marks a point on that pad's centre or on a via; arc(x,y) is an arc through that point)
+3.3V: length 75.4
  Top Layer w0.254: U1.4 12.5,16.11 12.48,16.09 12.95,15.61 12.95,13.84 13.59,13.2 15.56,13.2 16.1,12.66 v1(16.1,12.38) ; 16.26,27.21 16.29,27.17 v1(16.9,27.17)
  Bottom Layer w0.254: R4.2 12.07,2.79 17.65,2.79 20.08,5.22 20.08,5.58 20.07,5.58 20.07,5.71 ; R4.2 8.89,5.97 R3.2 ; R4.2 10.79,3.8 8,3.8 5.99,1.79 3.79,1.79 3.43,2.15 3.43,4.06 U6.7 ; R2.2 20.07,6.38 19.35,7.09 19.35,8.12 20.07,8.83 R1.2 18.3,10.79 16.76,10.79 16.1,11.46 v1(16.1,12.38) 15.37,13.11 U15.1 15.31,14.09 14.74,14.09 14.48,14.34 14.48,15.61 14.8,15.93 U15.3 16.38,15.93 18.35,17.9 22.35,17.9 23.11,18.66 23.11,21.33 22.61,21.84 19.3,21.84 18.67,22.47 18.67,25.41 v1(16.9,27.17)
AGND: length 129.6
  Top Layer w0.254: v1(22.44,25.53) 22.44,29.76 22.37,29.82 v1(14.86,29.82) ; v1(18.32,43.17) 13.59,38.44 4.98,38.44 2.17,41.26 2.17,42.78 ; v1(18.32,43.17) 18.34,43.19 19.79,43.19 19.81,43.17 ; v1(18.32,43.17) 18.32,33.28 v1(14.86,29.82) ; 14.7,18.79 14.1,18.79 U1.33 12.1,20.79 U1.22 12.1,23.71 11.62,24.19 C32.1 11.61,24.77 11.61,26.17 ; v1(14.86,29.82) 14.7,29.82 13.52,28.64 9.09,28.64 8.51,28.06 v1(8.51,27.68) ; CN2.2 21.21,42.03 21.21,36.57 v1(22.61,35.17) ; C10.1 C11.1 ; C14.1 C15.1 C16.1 18.29,19.68 16.89,18.28 15.24,18.28
  Top Layer w0.28: 15.24,18.28 14.73,18.79
  Top Layer w0.29: v1(14.6,22.6) 14.51,22.6 U1.17 14.1,21.59 13.3,20.79 14.7,20.79
  Top Layer w0.3: v1(14.6,22.6) 17.53,25.53 v1(22.44,25.53) ; C32.1 C11.1 ; 13.52,28.64 C10.1
  Bottom Layer w0.254: R11.2 v1(14.6,22.6) ; R24.1 R23.1
  Bottom Layer w0.3: C34.2 C35.2 8.51,26.85 v1(8.51,27.68) ; v1(14.6,22.6) 14.35,22.85 C3.2 14.35,23.43 C4.1 C5.1
  Bottom Layer w0.4: R51.1 14.86,30.72 ; 14.86,30.72 14.86,33.59 C50.1 ; 14.86,30.72 v1(14.86,29.82) ; C30.2 24.19,36.76 v1(22.61,35.17) 21.34,33.9 21.34,33.58 21.27,33.52 ; C40.1 14.85,40.94 R41.1 18.06,43.43 v1(18.32,43.17)
  Bottom Layer w0.5: CN1.2 2.16,43.28 2.16,40.4 D1.3
AVDD: length 6
  Top Layer w0.254: U1.23 11.7,23.28 C32.2 10.22,26.16 C31.2 10.21,27.39 10.38,27.55
GND: length 76
  Top Layer w0.254: 13.91,14.85 13.91,15.3 v1(13.8,15.41) 12.9,16.3 U1.5 ; U7.8 22.35,5.45 22.1,5.45 21.97,5.58 19.69,5.58 19.18,6.09 ; 13.97,14.79 15.37,14.79 ; 4.95,2.92 5.21,2.92 ; U6.8 4.83,2.92 H1.5 7.49,5.58 18.67,5.58 v1(19.18,6.09)
  Bottom Layer w0.254: v1(13.8,15.41) 13.8,15.69 15.88,17.77 C6.1 17.15,17.97 17.15,18.28 18.22,19.36 C18.1 C17.1 ; v1(13.8,15.41) 12.19,17.01 12.19,20.7 ; v1(13.8,15.41) 13.8,13.5 15.37,11.93 15.37,10.79 16.13,10.03 16.83,10.03 17.72,9.14 C1.2 17.84,7.73 X1.2 17.92,7.35 v1(19.18,6.09) ; U15.2 19.12,14.98 C33.1 20.57,15.04 C7.1 C8.1 22.54,15.05 23.24,14.34 23.24,6.6 22.1,5.45
VCC_P1V8: length 28.7
  Top Layer w0.254: 20.7,15.49 21.93,16.72 v1(21.93,18.48) ; v1(20.15,12.69) 20.7,13.24 20.7,15.45 ; 11.47,27.55 12.1,26.92 v1(12.7,26.92)
  Bottom Layer w0.254: C8.2 21.97,13.08 21.59,12.69 v1(20.15,12.69) 19.42,12.69 R10.2 ; v1(21.93,18.48) 22.1,18.65 L6.1 22.35,19.89 22.65,20.19 22.65,21.12 22.33,21.44 18.81,21.44 18.16,22.09 18.16,25.01 17.02,26.16 13.34,26.16 12.7,26.79 v1(12.7,26.92)
ADC_MIKRO: length 12.2
  Top Layer w0.254: U6.5 2.67,10.53 5.21,8
  Bottom Layer w0.254: R8.2 6.22,14.03 6.27,13.98 6.27,9.06 5.21,8
BCLK_CODEC: length 15.5
  Top Layer w0.254: v1(9.54,20.16) 9.68,20.16 9.85,19.99 U1.29 ; 10.41,10.16 12.69,10.16 12.7,10.15
  Bottom Layer w0.254: U8.1 10.67,11.55 10.67,19.04 9.56,20.16 v1(9.54,20.16)
BCLK_MIKRO: length 9
  Top Layer w0.254: 10.41,11.67 10.28,11.81 6.48,11.81 5.21,13.08 U6.4
BYP: length 1.5
  Bottom Layer w0.254: C33.2 18.42,16.44 U15.4
CPCA: length 1.7
  Top Layer w0.27: v1(14.53,17.95) 14.34,17.95 U1.8
  Bottom Layer w0.3: v1(14.53,17.95) 14.53,18 C2.1
CPCB: length 2.2
  Top Layer w0.27: v1(15.6,19) 15.42,19.19 U1.10
  Bottom Layer w0.3: C2.2 14.81,19.79 v1(15.6,19)
CPVDD: length 11.7
  Top Layer w0.25: 17.4,16 15.54,16 13.92,17.61 13.89,17.61 13.72,17.77 13.72,17.81 13.72,17.81 13.72,18.17
  Top Layer w0.254: 17.4,16 17.91,15.49 L5.2 19.9,16.86 C14.2 C15.2 C16.2
CPVOUTN: length 4.5
  Top Layer w0.254: v1(16.64,20.17) 16.45,19.99 14.45,19.99
  Bottom Layer w0.254: v1(16.64,20.17) 15.75,21.06 C4.2
CPVOUTP: length 5.3
  Top Layer w0.254: 14.45,19.59 14.45,19.58 15.97,19.58 16.22,19.33 v1(16.64,19.33)
  Bottom Layer w0.254: C5.2 17.27,19.97 v1(16.64,19.33)
DAC_MIKRO: length 9.4
  Top Layer w0.254: 5.21,5.45 2.67,8 U6.6
  Bottom Layer w0.254: 7.24,9.14 6.98,8.88 6.98,6.09 6.35,5.45 5.21,5.45
DAT_CODEC_DSP: length 5.4
  Top Layer w0.254: 9.54,18.43 10.28,19.17 10.68,19.17
  Bottom Layer w0.254: R8.1 6.72,17 7.11,17.39 8.67,17.39 v1(9.63,18.35)
DAT_DSP_CODEC: length 9.3
  Top Layer w0.254: 10.7,18.79 10.7,18.66 10.21,18.17 10.21,17.83 v1(10.08,17.7)
  Bottom Layer w0.254: R9.1 7.49,15.11 v1(10.08,17.7)
DCVDD: length 11.7
  Top Layer w0.254: v1(13.83,16.64) 13.3,17.17 U1.6
  Bottom Layer w0.254: v1(13.83,16.64) 14.07,16.64 16,18.57 16.79,18.57 18.99,20.76 C18.2 C17.2 21.82,20.76 21.97,20.61
FS_CODEC: length 7.2
  Top Layer w0.254: v1(9.59,19.3) 9.65,19.3 9.91,19.57 10.68,19.57
  Bottom Layer w0.254: v1(9.59,19.3) 8.44,18.16 5.72,18.16 R7.1
FS_MIKRO: length 8.7
  Bottom Layer w0.254: 5.21,10.53 4.83,10.53 3.81,11.55 3.81,14.73 R7.2 4.45,15.61 U6.3
HPOUTL: length 8.8
  Top Layer w0.254: v1(19.81,22.73) 18.03,22.73 15.69,20.39 U1.13
  Bottom Layer w0.254: v1(19.81,22.73) 19.94,22.85 R21.2
HPOUTR: length 12.2
  Top Layer w0.254: U1.15 14.72,21.21 15.37,21.21 17.65,23.49 v1(21.46,23.49)
  Bottom Layer w0.254: 25.15,25.4 23.23,23.49 v1(21.46,23.49)
IN2L: length 20.4
  Top Layer w0.254: v1(9.76,23.36) 9.76,21.74 10.28,21.21 10.68,21.21
  Bottom Layer w0.254: C51.1 15.11,35.3 15.98,34.44 16,29.71 15.24,28.95 11.05,28.95 9.76,27.66 v1(9.76,23.36)
IN2R: length 23.5
  Top Layer w0.254: v1(10.67,23.36) 10.67,22.82 U1.24
  Bottom Layer w0.254: v1(10.67,23.36) 10.67,27.68 11.43,28.44 15.49,28.44 16.51,29.46 16.51,38.67 15.94,39.24 C41.1
IRQ: length 8.8
  Top Layer w0.254: U1.1 11.3,18.18 11.3,17.27 10.79,16.76 v1(10.08,16.76)
  Bottom Layer w0.254: R3.1 8.89,15.56 v1(10.08,16.76)
MCLK: length 40
  Top Layer w0.254: 10.68,20.41 10.28,20.41 9.78,20.92 v1(9.57,20.92) ; U7.3 26.16,14.34 26.16,7.74 25.27,6.85 13.84,6.85 13.72,6.98 U8.2
  Bottom Layer w0.254: U8.2 13.97,8.25 13.97,12.57 11.3,15.23 11.3,19.31 9.7,20.92 v1(9.57,20.92)
MICBIAS: length 41.5
  Top Layer w0.254: v1(13.06,23.19) 12.9,23.03 U1.20
  Bottom Layer w0.254: R42.2 2.29,46.22 0.7,44.63 0.7,30.79 2.54,28.95 R52.2 7.05,28.88 C35.1 C34.1 7.05,23.55 8.13,22.47 12.45,22.47 13.06,23.09 v1(13.06,23.19)
MICVDD: length 6
  Top Layer w0.254: 16.26,26.12 16.22,26.16 C10.2 C11.2 14.92,24.22 13.32,22.6 13.32,22.21
RING_L_IN: length 14.8
  Bottom Layer w0.4: D1.2 5.78,38.92 9.03,35.67 R50.1
  Bottom Layer w0.5: CN1.4 2.17,37.22 3.81,38.86 4.62,38.86 D1.2
RING_L_OUT: length 4.8
  Bottom Layer w0.254: R53.1 19.95,31.49 CN2.4
SCL: length 21.1
  Top Layer w0.254: v1(12.92,12.73) 12.92,12.48 13.72,11.68 20.83,11.68 U11.3 U7.5 ; v1(11.7,13.9) 11.68,13.92 11.68,18.26
  Bottom Layer w0.254: v1(11.7,13.9) 12.87,12.73 v1(12.92,12.73) ; 22.1,10.53 22.09,10.53 R1.1
SDA: length 23.6
  Top Layer w0.254: U1.3 12.1,15.33 12.32,15.11 12.32,12.31 13.34,11.3 20.19,11.3 20.83,10.66 20.83,8.76 21.59,8 U7.6
  Bottom Layer w0.254: 22.1,8 21.71,7.61 R2.1
TIP_R_IN: length 7.9
  Bottom Layer w0.4: D1.1 4.68,41.13 5.97,42.41 8.01,42.41 R40.1
  Bottom Layer w0.5: CN1.3 6.84,40.82 D1.1
TIP_R_OUT: length 10.3
  Bottom Layer w0.254: R54.1 26.16,32.62 26.16,36.89 C30.1 25.59,39.85 CN2.3
VOUT: length 4.1
  Bottom Layer w0.254: R10.1 17.91,12.94 U15.5 18.35,14.03 18.67,13.71 20.51,13.71 C7.2
XTAL: length 9.3
  Top Layer w0.254: U8.3 14.35,2.79 16.51,2.79 U16.2
  Bottom Layer w0.254: R5.1 13.34,3.8 U8.3
$1N1956: length 8.5
  Bottom Layer w0.254: C1.1 16.44,9.08 16.51,9.01 16.51,6.8 16.44,6.73 16.44,6.68 16.28,6.52 16.23,6.52 X1.4 15.42,5.71 11.18,5.71 R4.1
$1N2019: length 2.3
  Bottom Layer w0.254: R5.2 17.46,4.51 X1.3
$1N2542: length 4
  Top Layer w0.254: 12.48,21.98 12.48,23.59 v1(12.84,23.95)
  Bottom Layer w0.254: C3.1 13.71,24.82 v1(12.84,23.95)
$1N6160: length 1.6
  Bottom Layer w0.254: R23.2 21.46,28.38 C27.2
$1N6186: length 1.6
  Bottom Layer w0.254: C28.2 23.56,26.97 R24.2
$1N6190: length 3.1
  Bottom Layer w0.254: R54.2 25.02,28.5 C28.1 25.02,28.38 R22.1
$1N48473: length 10.7
  Bottom Layer w0.254: R42.1 9.01,46.22 10.53,44.7 R40.2
  Bottom Layer w0.4: R40.2 R41.2 13.34,40.94 C40.2 C41.2
$1N48477: length 10.7
  Bottom Layer w0.254: R50.2 10.53,29.58 9.9,28.95 R52.1
  Bottom Layer w0.4: C51.2 C50.2 13.4,30.78 R51.2 R50.2
$1N58808: length 3.1
  Bottom Layer w0.254: R53.2 19.94,28.5 C27.1 20,26.97 R21.1
$1N85452: length 2.3
  Bottom Layer w0.254: U16.1 R55.2
$1N87497: length 28.5
  Bottom Layer w0.254: U6.2 0.63,16.76 0.63,1.9 1.78,0.76 6.98,0.76 7.62,1.39 R55.1

## Copper pours and planes (outline as drawn; the poured copper is in the pictures)
AGND on Top Layer: 0,47.87 26.92,47.87 26.92,22.85 0,22.85
AGND on Top Layer: 11.18,26.66 13.95,26.66 13.95,24.12 11.18,24.12
GND on Bottom Layer: 0.38,20.06 27.05,20.06 27.05,0.25 0.38,0.25

Small or netless copper shapes (teardrops, artwork), in the pictures only: 1 on Top Layer

## Text on the board
Top Silkscreen Layer: XTAL / OUT | BCLK | CtoD | DtoC | FS | GND | WM8904 | MCLK | XTAL | SCL | SDA | INPUT | OUTPUT | rev.5
